# Altium schematic sheet CCE_Simonduino_01.SchDoc: Simonduino Color Match Game
size A2; Author: Andre' LaMothe; DrawnBy: Andre' LaMothe; Revision: 1.0
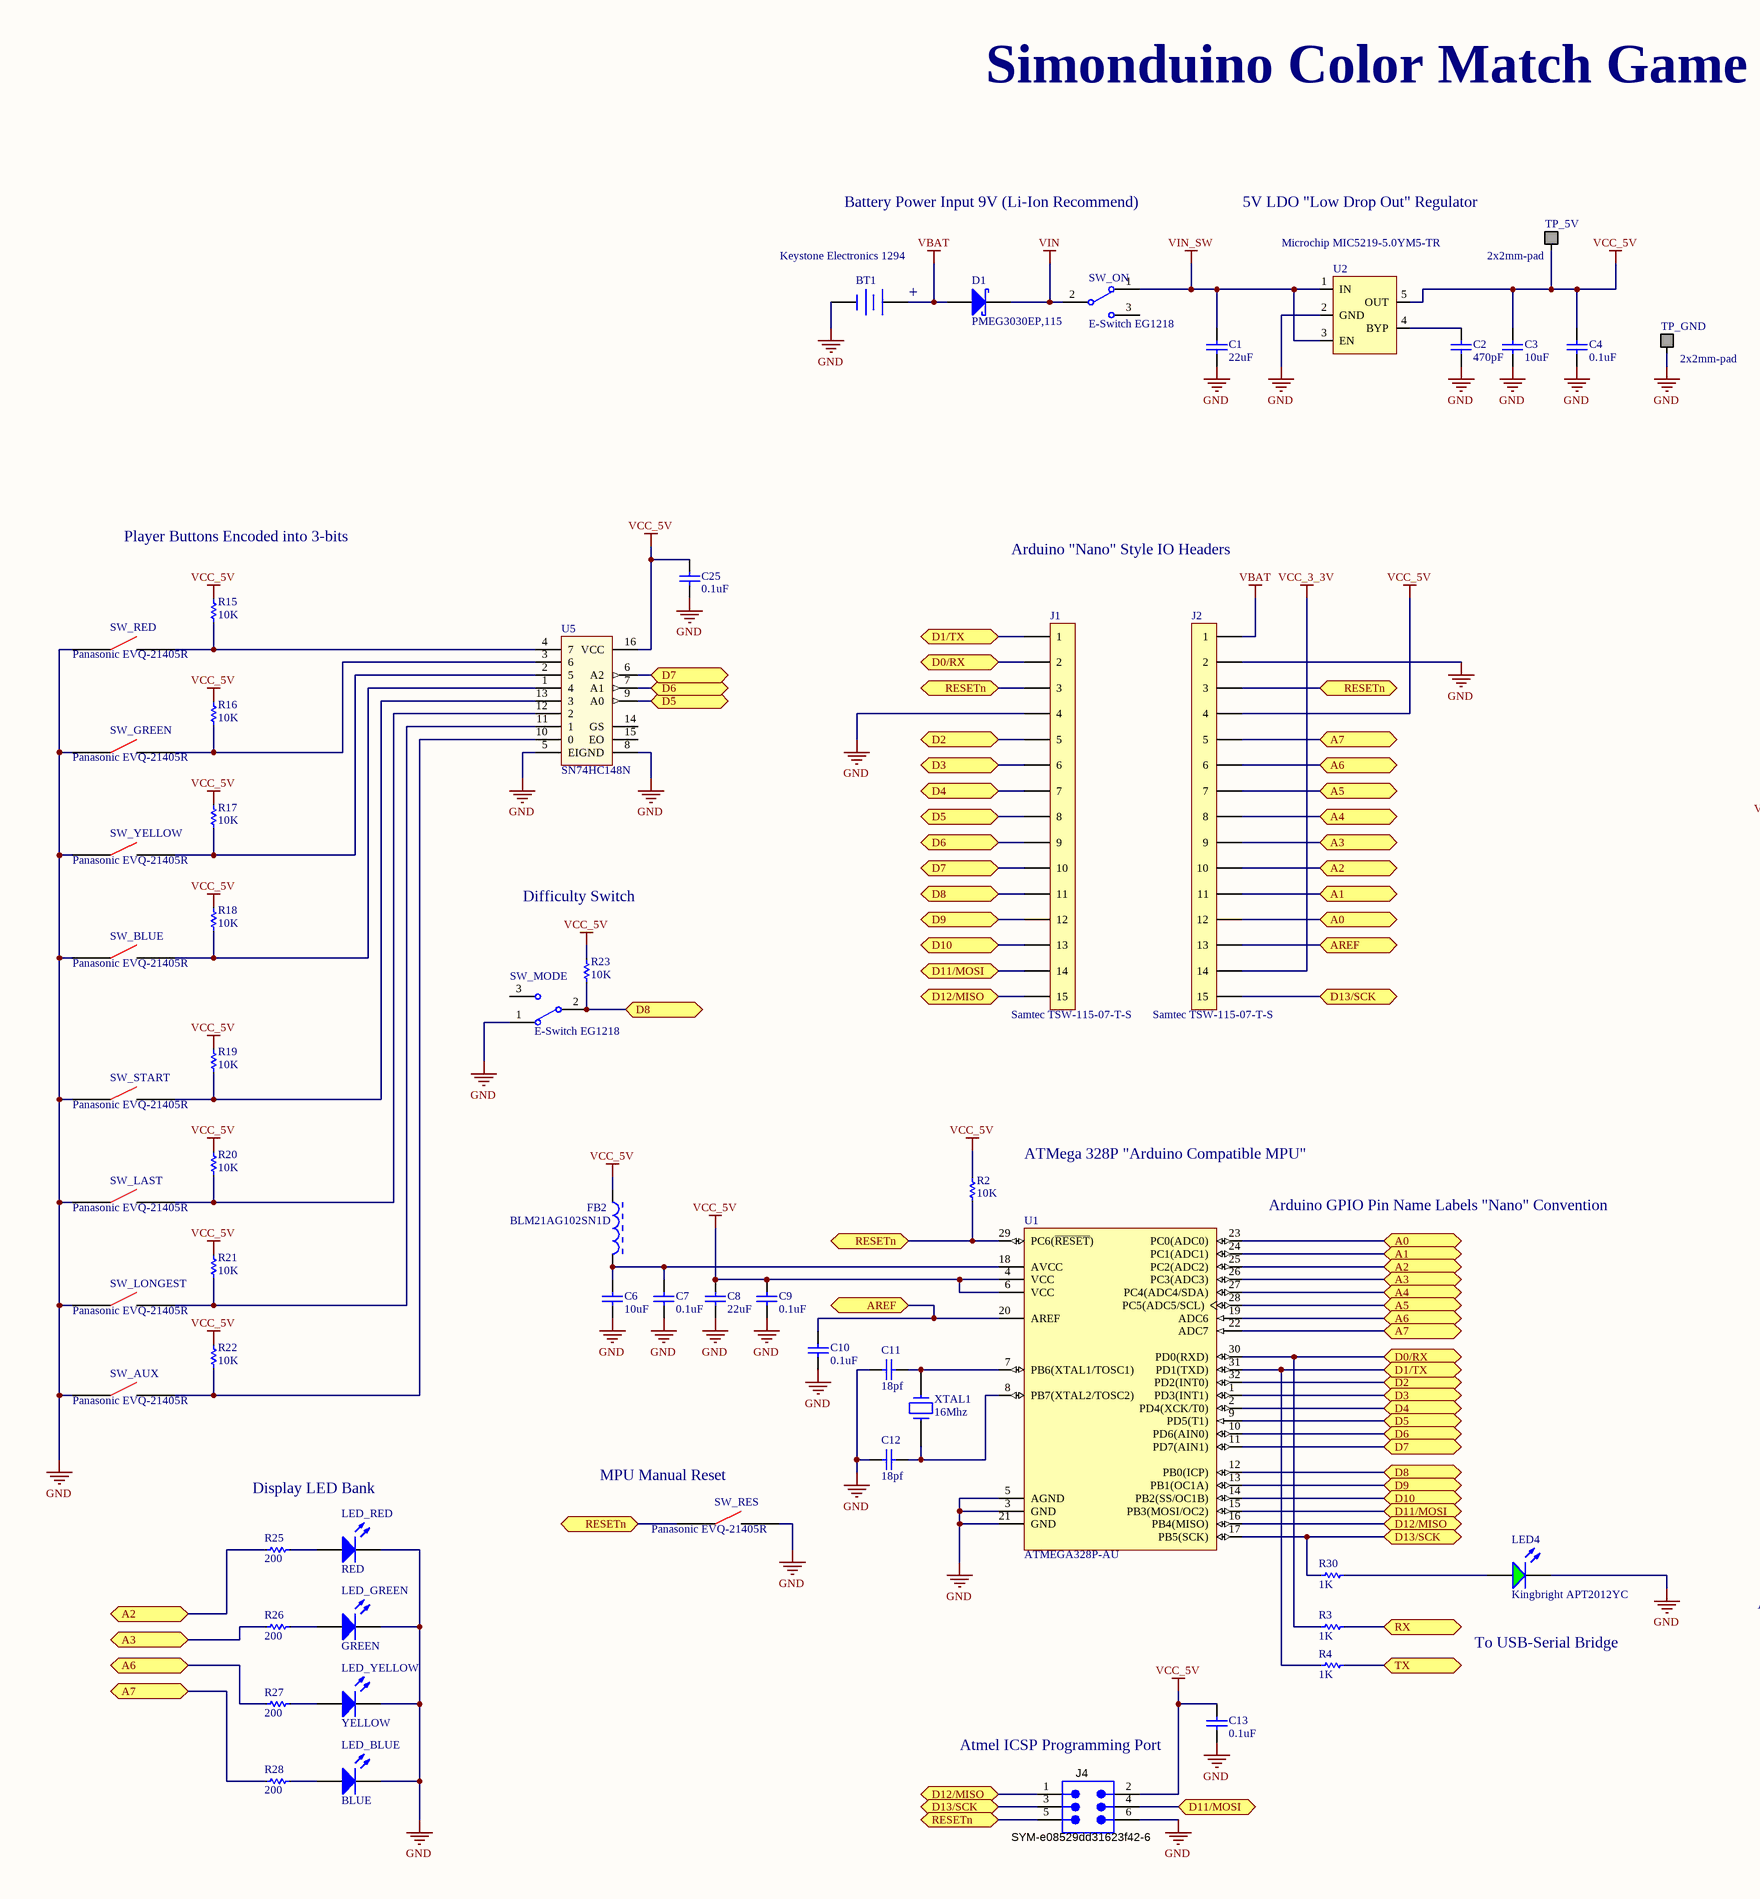
[diagram p0: CCE_Simonduino_01.SchDoc, left]
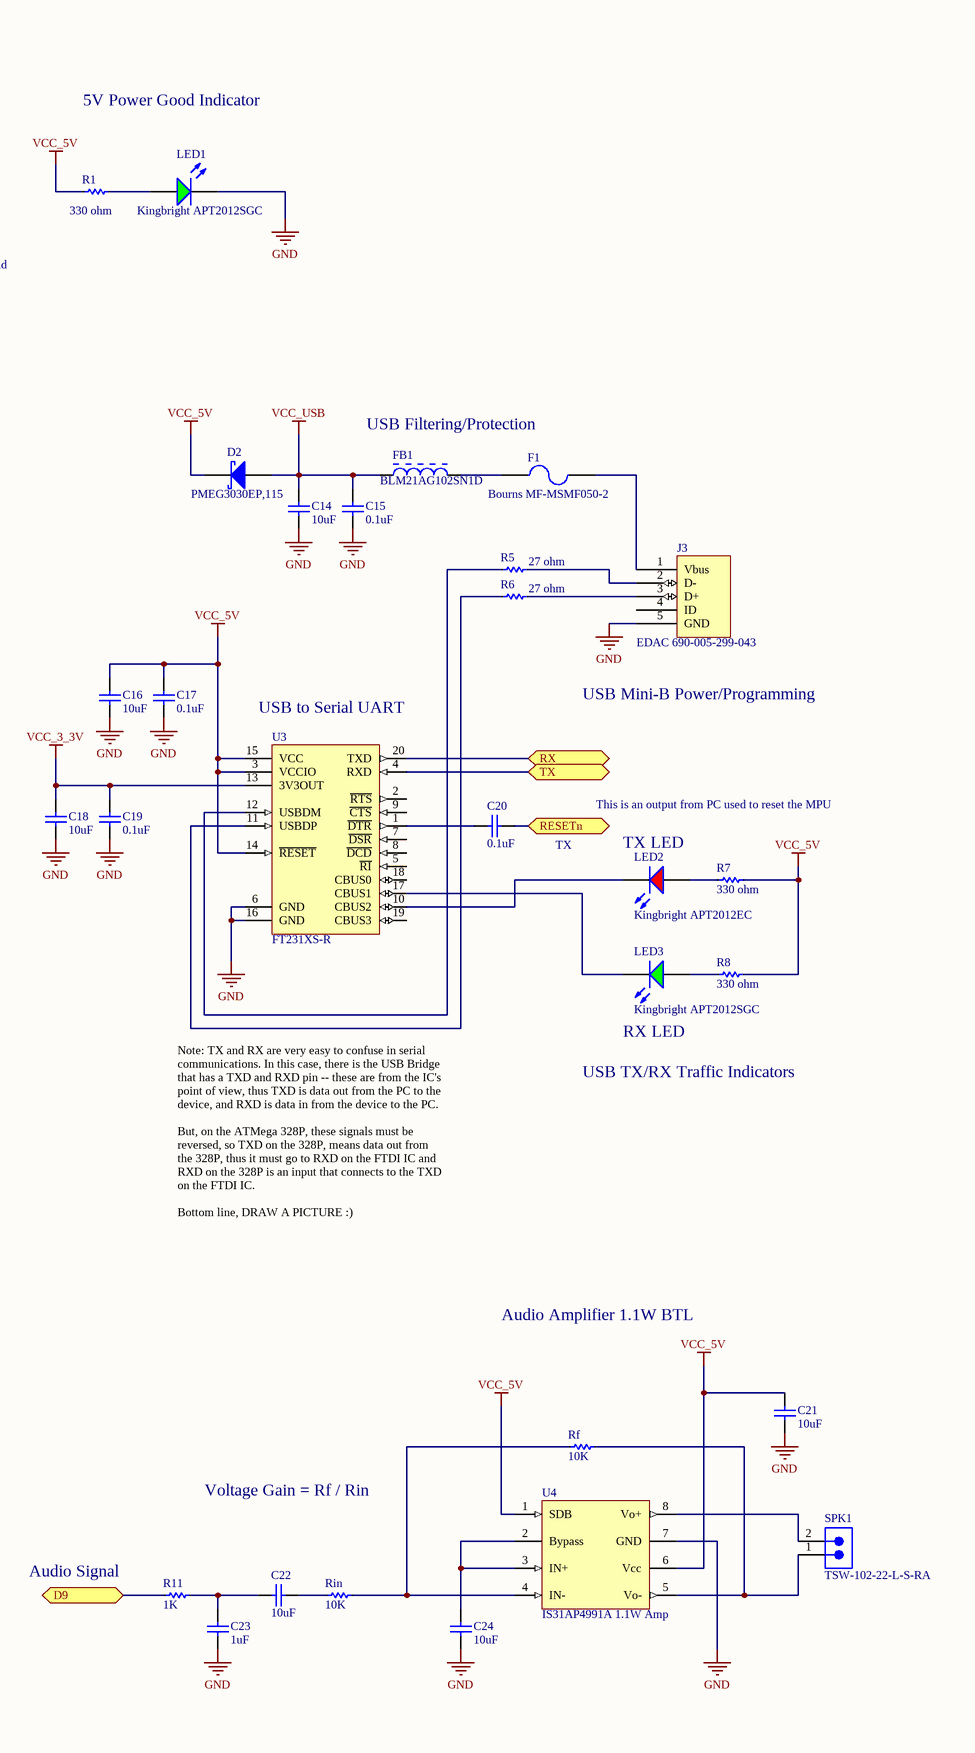
[diagram p1: CCE_Simonduino_01.SchDoc, right]

## Parts
BT1  Keystone Electronics 1294  [PCB-3798-1]
C1  22uF  [RLP133A]
C2  470pF  [RLP133A]
C3  10uF  [RLP133A]
C4  0.1uF  [RLP133A]
C6  10uF  [RLP133A]
C7  0.1uF  [RLP133A]
C8  22uF  [RLP133A]
C9  0.1uF  [RLP133A]
C10  0.1uF  [RLP133A]
C11  18pf  [RLP133A]
C12  18pf  [RLP133A]
C13  0.1uF  [RLP133A]
C14  10uF  [RLP133A]
C15  0.1uF  [RLP133A]
C16  10uF  [RLP133A]
C17  0.1uF  [RLP133A]
C18  10uF  [RLP133A]
C19  0.1uF  [RLP133A]
C20  0.1uF  [RLP133A]
C21  10uF  [RLP133A]
C22  10uF  [RLP133A]
C23  1uF  [RLP133A]
C24  10uF  [RLP133A]
C25  0.1uF  [RLP133A]
D1  PMEG3030EP,115  [PCB-ylvpw7uho1dkst7hexks-1]
D2  PMEG3030EP,115  [PCB-ylvpw7uho1dkst7hexks-1]
F1  Bourns MF-MSMF050-2  [L1812]
FB1  BLM21AG102SN1D  [MURA-BLM21-H1-CHIP-2_V]
FB2  BLM21AG102SN1D  [MURA-BLM21-H1-CHIP-2_V]
J1  Samtec TSW-115-07-T-S  [PCB-ss9uik38su1ryg1jck95-1]
J2  Samtec TSW-115-07-T-S  [PCB-ss9uik38su1ryg1jck95-1]
J3  EDAC 690-005-299-043  [PCB-0dqtvzwtjwndkeioqta0-1]
J4  SYM-e08529dd31623f42-6  [PCB-2h1t0rpz2tx2wsc79kkt-1]
LED1  Kingbright APT2012SGC  [CHIPLED_0805_NOOUTLINE]
LED2  Kingbright APT2012EC  [CHIPLED_0805_NOOUTLINE]
LED3  Kingbright APT2012SGC  [CHIPLED_0805_NOOUTLINE]
LED4  Kingbright APT2012YC  [CHIPLED_0805_NOOUTLINE]
LED_BLUE  BLUE  [PCB-teu6t62n2bsx7jl1if62-1]
LED_GREEN  GREEN  [PCB-teu6t62n2bsx7jl1if62-1]
LED_RED  RED  [PCB-teu6t62n2bsx7jl1if62-1]
LED_YELLOW  YELLOW  [PCB-teu6t62n2bsx7jl1if62-1]
R1  330 ohm  [RESC2013X70X40LL20T20]
R2  10K  [RESC2013X70X40LL20T20]
R3  1K  [RESC2013X70X40LL20T20]
R4  1K  [RESC2013X70X40LL20T20]
R5  27 ohm  [RESC2013X70X40LL20T20]
R6  27 ohm  [RESC2013X70X40LL20T20]
R7  330 ohm  [RESC2013X70X40LL20T20]
R8  330 ohm  [RESC2013X70X40LL20T20]
R11  1K  [RESC2013X70X40LL20T20]
R15  10K  [RESC2013X70X40LL20T20]
R16  10K  [RESC2013X70X40LL20T20]
R17  10K  [RESC2013X70X40LL20T20]
R18  10K  [RESC2013X70X40LL20T20]
R19  10K  [RESC2013X70X40LL20T20]
R20  10K  [RESC2013X70X40LL20T20]
R21  10K  [RESC2013X70X40LL20T20]
R22  10K  [RESC2013X70X40LL20T20]
R23  10K  [RESC2013X70X40LL20T20]
R25  200  [RESC2013X70X40LL20T20]
R26  200  [RESC2013X70X40LL20T20]
R27  200  [RESC2013X70X40LL20T20]
R28  200  [RESC2013X70X40LL20T20]
R30  1K  [RESC2013X70X40LL20T20]
Rf  10K  [RESC2013X70X40LL20T20]
Rin  10K  [RESC2013X70X40LL20T20]
SPK1  TSW-102-22-L-S-RA  [SMTC-TSW-102-22-X-S-RA]
SW_AUX  Panasonic EVQ-21405R  [PCB-je10m8m3eogq13l465bo-1]
SW_BLUE  Panasonic EVQ-21405R  [PCB-je10m8m3eogq13l465bo-1]
SW_GREEN  Panasonic EVQ-21405R  [PCB-je10m8m3eogq13l465bo-1]
SW_LAST  Panasonic EVQ-21405R  [PCB-je10m8m3eogq13l465bo-1]
SW_LONGEST  Panasonic EVQ-21405R  [PCB-je10m8m3eogq13l465bo-1]
SW_MODE  E-Switch EG1218  [ESWI-EG1218_V]
SW_ON  E-Switch EG1218  [ESWI-EG1218_V]
SW_RED  Panasonic EVQ-21405R  [PCB-je10m8m3eogq13l465bo-1]
SW_RES  Panasonic EVQ-21405R  [PCB-je10m8m3eogq13l465bo-1]
SW_START  Panasonic EVQ-21405R  [PCB-je10m8m3eogq13l465bo-1]
SW_YELLOW  Panasonic EVQ-21405R  [PCB-je10m8m3eogq13l465bo-1]
TP_5V  2x2mm-pad  [PCB-iek5qk9ganu4yn12lo6h-1]
TP_GND  2x2mm-pad  [PCB-iek5qk9ganu4yn12lo6h-1]
U1  ATMEGA328P-AU  [TQFP32-08]
U2  Microchip MIC5219-5.0YM5-TR  [PCB-wkjlo8hhy83bmub82728-1]
U3  FT231XS-R  [SSOP20_L]
U4  IS31AP4991A 1.1W Amp  [PCB-9rmbxp4o58shl47xlmib-1]
U5  SN74HC148N  [PCB-humlfp2qb5uk19pmpc47-1]
XTAL1  16Mhz  [PCB-tw4o7k9ciwtd4bkcirmp-1]

## Ports
A0 (bidir), A1 (bidir), A2 (bidir), A3 (bidir), A4 (bidir), A5 (bidir), A6 (bidir), A7 (bidir), AREF (bidir), D0/RX (bidir), D1/TX (bidir), D2 (bidir), D3 (bidir), D4 (bidir), D5 (bidir), D6 (bidir), D7 (bidir), D8 (bidir), D9 (bidir), D10 (bidir), D11/MOSI (bidir), D12/MISO (bidir), D13/SCK (bidir), RESETn (bidir), RX (bidir), TX (bidir)

## Nets
GND: BT1.2(-) C1.1 C2.1 C3.1 C4.1 C6.1 C7.1 C8.1 C9.1 C10.2 C11.2 C12.2 C13.2 C14.1 C15.1 C16.1 C17.1 C18.1 C19.1 C21.1 C23.2 C24.1 C25.1 J1.4 J2.2 J3.5(GND) J4.6 LED1.C LED4.C LED_BLUE.1(K) LED_GREEN.1(K) LED_RED.1(K) LED_YELLOW.1(K) SW_AUX.1 SW_BLUE.1 SW_GREEN.1 SW_LAST.1 SW_LONGEST.1 SW_MODE.1 SW_RED.1 SW_RES.2 SW_START.1 SW_YELLOW.1 TP_GND.1 U1.3(GND) U1.5(AGND) U1.21(GND) U2.2(GND) U3.6(GND) U3.16(GND) U4.7(GND) U5.5(EI) U5.8(GND)
VBAT: BT1.1(+) D1.1(A) J2.1
VCC_3_3V: C18.2 C19.2 J2.14 U3.13(3V3OUT)
VCC_5V: C3.2 C4.2 C8.2 C9.2 C13.1 C16.2 C17.2 C21.2 C25.2 D2.2(K) FB2.1 J2.4 J4.2 R1.1 R2.2 R7.1 R8.1 R15.1 R16.1 R17.1 R18.1 R19.1 R20.1 R21.1 R22.1 R23.1 TP_5V.1 U1.4(VCC) U1.6(VCC) U2.5(OUT) U3.3(VCCIO) U3.14(~{RESET}) U3.15(VCC) U4.1(SDB) U4.6(Vcc) U5.16(VCC)
VCC_USB: C14.2 C15.2 D2.1(A) FB1.1
VIN: D1.2(K) SW_ON.2(COM)
VIN_SW: C1.2 SW_ON.1 U2.1(IN) U2.3(EN)
A0: J2.12 U1.23(PC0(ADC0)) ; port A0
A1: J2.11 U1.24(PC1(ADC1)) ; port A1
A2: J2.10 R25.1 U1.25(PC2(ADC2)) ; port A2
A3: J2.9 R26.1 U1.26(PC3(ADC3)) ; port A3
A4: J2.8 U1.27(PC4(ADC4/SDA)) ; port A4
A5: J2.7 U1.28(PC5(ADC5/SCL)) ; port A5
A6: J2.6 R27.1 U1.19(ADC6) ; port A6
A7: J2.5 R28.1 U1.22(ADC7) ; port A7
AREF: C10.1 J2.13 U1.20(AREF) ; port AREF
D0/RX: J1.2 R3.1 U1.30(PD0(RXD)) ; port D0/RX
D1/TX: J1.1 R4.1 U1.31(PD1(TXD)) ; port D1/TX
D2: J1.5 U1.32(PD2(INT0)) ; port D2
D3: J1.6 U1.1(PD3(INT1)) ; port D3
D4: J1.7 U1.2(PD4(XCK/T0)) ; port D4
D5: J1.8 U1.9(PD5(T1)) U5.9(A0) ; port D5
D6: J1.9 U1.10(PD6(AIN0)) U5.7(A1) ; port D6
D7: J1.10 U1.11(PD7(AIN1)) U5.6(A2) ; port D7
D8: J1.11 R23.2 SW_MODE.2(COM) U1.12(PB0(ICP)) ; port D8
D9: J1.12 R11.2 U1.13(PB1(OC1A)) ; port D9
D10: J1.13 U1.14(PB2(SS/OC1B)) ; port D10
D11/MOSI: J1.14 J4.4 U1.15(PB3(MOSI/OC2)) ; port D11/MOSI
D12/MISO: J1.15 J4.1 U1.16(PB4(MISO)) ; port D12/MISO
D13/SCK: J2.15 J4.3 R30.1 U1.17(PB5(SCK)) ; port D13/SCK
RESETn: C20.1 J1.3 J2.3 J4.5 R2.1 SW_RES.1 U1.29(PC6(~{RESET})) ; port RESETn
RX: R3.2 U3.20(TXD) ; port RX
TX: R4.2 U3.4(RXD) ; port TX
NetC2_2: C2.2 U2.4(BYP)
NetC6_2: C6.2 C7.2 FB2.2 U1.18(AVCC)
NetC11_1: C11.1 U1.7(PB6(XTAL1/TOSC1)) XTAL1.2
NetC12_1: C12.1 U1.8(PB7(XTAL2/TOSC2)) XTAL1.1
NetC20_2: C20.2 U3.1(~{DTR})
NetC22_1: C22.1 Rin.1
NetC22_2: C22.2 C23.1 R11.1
NetC24_2: C24.2 U4.2(Bypass) U4.3(IN+)
NetF1_1: F1.1 FB1.2
NetF1_2: F1.2 J3.1(Vbus)
NetJ3_2: J3.2(D-) R5.2
NetJ3_3: J3.3(D+) R6.2
NetLED1_A: LED1.A R1.2
NetLED2_A: LED2.A R7.2
NetLED2_C: LED2.C U3.10(CBUS2)
NetLED3_A: LED3.A R8.2
NetLED3_C: LED3.C U3.17(CBUS1)
NetLED4_A: LED4.A R30.2
NetLED_BLUE_2: LED_BLUE.2(A) R28.2
NetLED_GREEN_2: LED_GREEN.2(A) R26.2
NetLED_RED_2: LED_RED.2(A) R25.2
NetLED_YELLOW_2: LED_YELLOW.2(A) R27.2
NetR5_1: R5.1 U3.12(USBDM)
NetR6_1: R6.1 U3.11(USBDP)
NetR15_2: R15.2 SW_RED.2 U5.4(7)
NetR16_2: R16.2 SW_GREEN.2 U5.3(6)
NetR17_2: R17.2 SW_YELLOW.2 U5.2(5)
NetR18_2: R18.2 SW_BLUE.2 U5.1(4)
NetR19_2: R19.2 SW_START.2 U5.13(3)
NetR20_2: R20.2 SW_LAST.2 U5.12(2)
NetR21_2: R21.2 SW_LONGEST.2 U5.11(1)
NetR22_2: R22.2 SW_AUX.2 U5.10(0)
NetRf_1: Rf.1 Rin.2 U4.4(IN-)
NetRf_2: Rf.2 SPK1.1 U4.5(Vo-)
NetSPK1_2: SPK1.2 U4.8(Vo+)

Not connected (* = marked no-connect by the designer): J3 4(ID); SW_MODE 3; SW_ON 3; U3 2(~{RTS}) 5(~{RI}) 7(~{DSR}) 8(~{DCD}) 9(~{CTS}) 18(CBUS0) 19(CBUS3); U5 14(GS) 15(EO)

## Notes on the sheet
- Simonduino Color Match Game
- Battery Power Input 9V (Li-Ion Recommend)
- 5V LDO "Low Drop Out" Regulator
- 5V Power Good Indicator
- (near BT1) +
- Player Buttons Encoded into 3-bits
- USB Filtering/Protection
- Arduino "Nano" Style IO Headers
- (near U3) USB to Serial UART
- USB Mini-B Power/Programming
- Difficulty Switch
- TX
- This is an output from PC used to reset the MPU
- (near LED2) TX LED
- RX LED
- ATMega 328P "Arduino Compatible MPU"
- USB TX/RX Traffic Indicators
- Arduino GPIO Pin Name Labels "Nano" Convention
- Note: TX and RX are very easy to confuse in serial
  communications. In this case, there is the USB Bridge
  that has a TXD and RXD pin -- these are from the IC's
  point of view, thus TXD is data out from the PC to the
  device, and RXD is data in from the device to the PC.
  But, on the ATMega 328P, these signals must be
  reversed, so TXD on the 328P, means data out from
  the 328P, thus it must go to RXD on the FTDI IC and
  RXD on the 328P is an input that connects to the TXD
  on the FTDI IC.
  Bottom line, DRAW A PICTURE :)
- Audio Amplifier 1.1W BTL
- Display LED Bank
- (near SW_RES) MPU Manual Reset
- Voltage Gain = Rf / Rin
- (near R11) Audio Signal
- To USB-Serial Bridge
- Atmel ICSP Programming Port
- Title
- Size:
- Date:
- File:
- A2
- Number:
- Time:
- Revision:
- Sheet
- of

## Library data of the parts
BT1 = 1294: HOLDER BATT 9V UNIV PLASTIC PC; Lead-Free Status: Lead Free; Number of Contacts: 2; Octopart Url: https://octopart.com/1294-keystone-3743; Material: Plastic; REACH SVHC Compliance: No SVHC; Contact Plating: Nickel; RoHS: Compliant; Packaging: Bulk; OctopartID: fd44344ed6bd2283; Contact Material: Steel
C1 C3 C4 C6-C25 = 08055C104KAT2A: Generic Multilayer Ceramic Capacitor SMD 0805 (2012); Voltage Rating (DC): 50.0 V; Capacitance: 100 nF; Insulation Resistance: 100 GΩ; Lead-Free Status: Lead Free; Packaging: Cut Tape (CT), Tape & Reel (TR); Mounting Style: Surface Mount; Number of Pins: 2; Size-Length: 2.01 mm
C2 = CMP-3c98f6df3913e35f-11: Generic Multilayer Ceramic Capacitor SMD 0805 (2012); Voltage Rating (DC): 50.0 V; Capacitance: 100 nF; Insulation Resistance: 100 GΩ; Lead-Free Status: Lead Free; Packaging: Cut Tape (CT), Tape & Reel (TR); Mounting Style: Surface Mount; Number of Pins: 2; Size-Length: 2.01 mm
D1 D2 = PMEG3030EP,115: PMEG3030EP 3 A 30 Vrrm SMT MEGA Schottky Barrier Rectifier - SOD-128F; Lead-Free Status: Lead Free; RoHS: Compliant; OctopartID: 93505b4aaf424c97; Octopart URL: http://octopart.com/pmeg3030ep%2C115-nxp+semiconductors-17832308; Mounting Style: Surface Mount; Lifecycle Status: Active
F1 = MF-MSMF050-2: PTC RESETTABLE .50A 15V 1812; Lead-Free Status: Lead Free; Power Dissipation: 0.8 W; Resistance: 0.15 Ω; Holding Current: 0.5 A; Voltage Rating (DC): 15.0 V; Case/Package (SI): 4532; Tripping Current: 1.0 A; Current Rating: 100.0 A; Case/Package: 1812; REACH SVHC Compliance: No SVHC; Size-Length: 0.00455 m; Size-Height: 0.00085 m; RoHS: Compliant; Mounting Style: Surface Mount; Size-Width: 0.00341 m; OctopartID: 9a15531fd2fc45d2; Operating Voltage: 15.0 V; Octopart Url: https://octopart.com/mf-msmf050-2-bourns-28047
FB1 FB2 = BLM21AG102SN1D: Chip Ferrite Bead for General Signal lines, 1000 Ohm, 500 mA, -55 to 125 degC, 2 x 1.25 x 1.05 mm SMD, Tape and Reel; Case/Package (SI): 2012; Current Rating: 0.2 A; Frequency: 100000000.0 Hz; Lead-Free Status: Lead Free; Number of Circuits: 1; Resistance: 1000.0 Ω; Shielding: No; Case/Package: 0805; Mounting Style: Surface Mount; Number of Pins: 2; Octopart Url: https://octopart.com/blm21ag102sn1d-murata-368343; OctopartID: 58c391cce3728704; REACH SVHC Compliance: No SVHC; RoHS: Compliant; Size-Height: 0.00085 m; Size-Length: 0.002 m; Size-Width: 0.00125 m
J1 J2 = TSW-115-07-T-S: Conn Unshrouded Header HDR 15 POS 2.54mm Solder ST Thru-Hole Automotive Bulk
J3 = CMP-f10139da97e32ec6-2: 5 Pin Right Angle Surface Mount Mini USB Type B
J4 = M20-9980346: 2.54mm (0.1") Pitch DIL Vertical PC Tail Pin Header, 6.1mm mating pin height, tin, 3+3 contacts; Number of Contacts: 6; Contact Plating: Tin; Manufacturer Part Number: M20-9980346; Contact Material: Phosphor Bronze; OctopartID: e08529dd31623f42
LED1 LED3 = APT2012SGC: LED 2X1.2MM 568NM GN WTR CLR SMD; Case/Package (SI): 2012; Color: Green; Lead-Free Status: Lead Free; Luminous Intensity: 0.015 cd; Viewing Angle: 120 °; Wavelength: 5.68e-07 m; Case/Package: 0805; Octopart Url: https://octopart.com/apt2012sgc-kingbright-868583; OctopartID: 33bcfabb563dec7b; Packaging: Reel; RoHS: Compliant
LED2 = APT2012EC: LED 2X1.2MM 625NM RD WTR CLR SMD; Case/Package (SI): 2012; Color: Red; Lead-Free Status: Lead Free; Luminous Intensity: 0.012 cd; Viewing Angle: 120 °; Wavelength: 6.25e-07 m; Case/Package: 0805; Octopart Url: https://octopart.com/apt2012ec-kingbright-868855; OctopartID: 365fff5852cee998; Packaging: Reel; RoHS: Compliant
LED4 = CMP-1546221-2: LED 2X1.2MM 568NM GN WTR CLR SMD; Case/Package (SI): 2012; Color: Yellow; Lead-Free Status: Lead Free; Luminous Intensity: 0.015 cd; Viewing Angle: 120 °; Wavelength: 5.68e-07 m; Case/Package: 0805; Octopart Url: https://octopart.com/apt2012sgc-kingbright-868583; OctopartID: 33bcfabb563dec7b; Packaging: Reel; RoHS: Compliant
LED_BLUE LED_GREEN LED_RED LED_YELLOW = CMP-92bb5b2eff764d7c-3: LED Uni-Color Green 2-Pin T-1 3/4 Bulk; Manufacturer Part Number: C503B-GCN-CY0C0791; Manufacturer: Cree; Viewing Angle: 30 °; Luminous Intensity: 12.5 cd; Wavelength: 527 nm; Forward Voltage: 3.20 V; RoHS: Compliant; Mounting Style: Through Hole; Octopart URL: http://octopart.com/c503b-gcn-cy0c0791-cree-10438827; Color: Green; OctopartID: 92bb5b2eff764d7c; Number of Pins: 2
R1-R8 R11 R15-R23 R25-R28 R30 Rf Rin = ERJ-6ENF1001V: @ RESISTOR,SMT,0805,1K OHM, +/-1%,+-100ppm,THICKFILM(100); Voltage Rating (DC): 150.0 V; Resistance Tolerance: ±1%; Case/Package (SI): 2012; Lead-Free Status: Lead Free; Resistance: 1000.0 Ω; Power Rating: 0.125 W; Mounting Style: Surface Mount; OctopartID: 00a1cae6889bdf66; Number of Pins: 2; Lifecycle Status: Not Listed by Manufacturer; Size-Length: 0.002 m; Octopart Url: https://octopart.com/erj-6enf1001v-panasonic-55422300; Case/Package: 0805; RoHS: Compliant; Size-Height: 0.0006 m; Size-Width: 0.00125 m; REACH SVHC Compliance: No SVHC
SPK1 = TSW-102-22-L-S-RA: 0.025" SQ Post Header, Through-hole, Right Angle, -55 to 125 degC, 2.54 mm Pitch, 2-Pin, Male, RoHS; Number of Contacts: 2; Pin Pitch: 0.00254 m; Contact Material: Phosphor Bronze; Contact Plating: Gold; Gender: Male; Mounting Style: Through Hole; Number of Rows: 1; Octopart Url: https://octopart.com/tsw-102-22-l-s-ra-samtec-11758137; OctopartID: 0b86c23f44d9d441; REACH SVHC Compliance: No SVHC; RoHS: Compliant
SW_AUX SW_BLUE SW_GREEN SW_LAST SW_LONGEST SW_RED SW_RES SW_START SW_YELLOW = CMP-2fe5e5be239cf022-2: Switch Tactile N.O. SPST Round Button PC Pins 0.02A 15VDC 1.3N Thru-Hole Radial T/R; Contact Current Rating: 20.0 mA; Contacts Type: SPST-NO; Actuator Type: Standard; Lead-Free Status: Lead Free; OctopartID: 2fe5e5be239cf022; Element14 Part No.: 2281982; Size-Width: 6.00 mm; Element14 Min Order: 1; Packaging: Tape & Reel (TR); Lifecycle Status: Not Listed by Manufacturer; Element14 Price Per: $0.109; Mounting Style: Through Hole, PC Board; Size-Length: 6.00 mm; Orientation: Vertical; Element14 URL: http://au.element14.com/panasonic-electronic-components/evq-21405r/switch-tactile-spst-no-20ma-15vdc/dp/2281982; Octopart URL: http://octopart.com/evq-21405r-panasonic-55650591; Manufacturer Part Number: EVQ-21405R; RoHS: Compliant
SW_MODE SW_ON = CMP-9a5a5340a2f5459d-7: Slide Switch, 500 V, -20 to 70 degC, 3-Pin THD, RoHS; Current Rating: 200 mA; Contacts Type: SPDT; Actuator Type: Standard; Number of Positions: 2; Lead-Free Status: Lead Free; OctopartID: 9a5a5340a2f5459d; PackageDescription: 3-Pin Through Hole Device, Body 11.6 x 4 mm, Pitch 2.5 mm; Orientation: Vertical; Mounting Style: PCB, Through Hole; DatasheetVersion: Oct-15; Size-Height: 5.40 mm; Manufacturer Part Number: EG1218; Contact Plating: Silver; Seller Landing  Url: https://octopart-clicks.com/click/track?country=US&ak=8157f166&sig=0e9adab&sid=459&ppid=1056201&vpid=1179261&ct=offers; Size-Length: 2.03 mm; Octopart Url: http://octopart.com/eg1218-e-switch-1056201; Contact Material: Copper Alloy; Size-Width: 4.00 mm; Packaging: Bulk; PackageReference: EG1218; RoHS: Compliant
TP_5V TP_GND = RCT-0C: Raychem; SMT Circuit probe pad, 0805, 0R0 RCT
U1 = ATMEGA328P-AU: Embedded microcontroller ATMEGA328P-AU TQFP 32 (7x7) Microchip Technology 8-Bit 20 MHz I/O number 23; RAM Memory Size: 2048 B; Lead-Free Status: Lead Free; Clock Speed: 20.0 MHz; Supply Voltage (DC): 1.80 V (min); Octopart URL: http://octopart.com/atmega328p-au-microchip-77760215; REACH SVHC Compliance: No SVHC; Manufacturer Part Number: ATMEGA328P-AU; RoHS: Compliant; Mounting Style: Surface Mount; OctopartID: 0674cbdca5c5d9b3; Number of Pins: 32; Lifecycle Status: Not Listed by Manufacturer
U2 = CMP-8be04111fcdb5427-1: MIC5219 Series 500 mA 5 V Fixed Output Surface Mount LDO Regulator - SOT-23-5; Input Voltage (DC): 12.0 V (max); Lead-Free Status: Lead Free; Output Current: 500 mA; Packaging: Tape, Tape & Reel (TR); Manufacturer Part Number: MIC5219-5.0YM5-TR; Lifecycle Status: Not Listed by Manufacturer; Mounting Style: Surface Mount; Octopart URL: http://octopart.com/mic5219-5.0ym5-tr-microchip-66802269; REACH SVHC Compliance: No SVHC; Case/Package: SOT-23; RoHS: Compliant; Number of Pins: 5; OctopartID: 8be04111fcdb5427
U3 = FT231XS-R: USB Full Speed to Full Handshake UART with USB Charger Detection; Mounting Style: Surface Mount; Seller Landing  Url: https://octopart-clicks.com/click/track?country=US&ak=8157f166&sig=0ac6205&sid=459&ppid=22061507&vpid=46595747&ct=offers; Octopart Url: http://octopart.com/ft231xs-r-ftdi-22061507; OctopartID: 526a9a30d6cf8dad; Packaging: Tape; RoHS: Compliant; Manufacturer Part Number: FT231XS-R
U4 = IS31AP4991A-GRLS2-TR: Audio Amp Speaker 1-CH Mono 1.4W Class-AB 8-Pin SOP T/R; Octopart URL: http://octopart.com/is31ap4991a-grls2-tr-issi-34842321
U5 = SN74HC148N: 8-Line To 3-Line Priority Encoders 16-SOIC -40 to 85; Supply Voltage (DC): V; Supply Current: 0.0001 A; Number of Circuits: 1; Voltage Nodes: 6.0, 5.0, 2.0 V; Output Current Drive: -0.001 A; Number of Outputs: 5; OctopartID: 21e6e8edbd0afe21; Manufacturer Part Number: SN74HC148N; REACH SVHC Compliance: No SVHC; Mounting Style: Surface Mount; Packaging: Tube; RoHS: Compliant; Octopart URL: http://octopart.com/sn74hc148n-texas+instruments-113034
XTAL1 = 9B-16.000MEEJ-B: Crystal 16.0000 MHz; Frequency: 16.0 MHz; Load Capacitance: 18.0 pF; RoHS: Compliant; Manufacturer Part Number: 9B-16.000MEEJ-B; Number of Pins: 2; Octopart URL: http://octopart.com/9b-16.000meej-b-txc-18803041